# EAGLE design HostInterfaceSplitter (EAGLE 6.6.0)

## Sheet 1 of 2
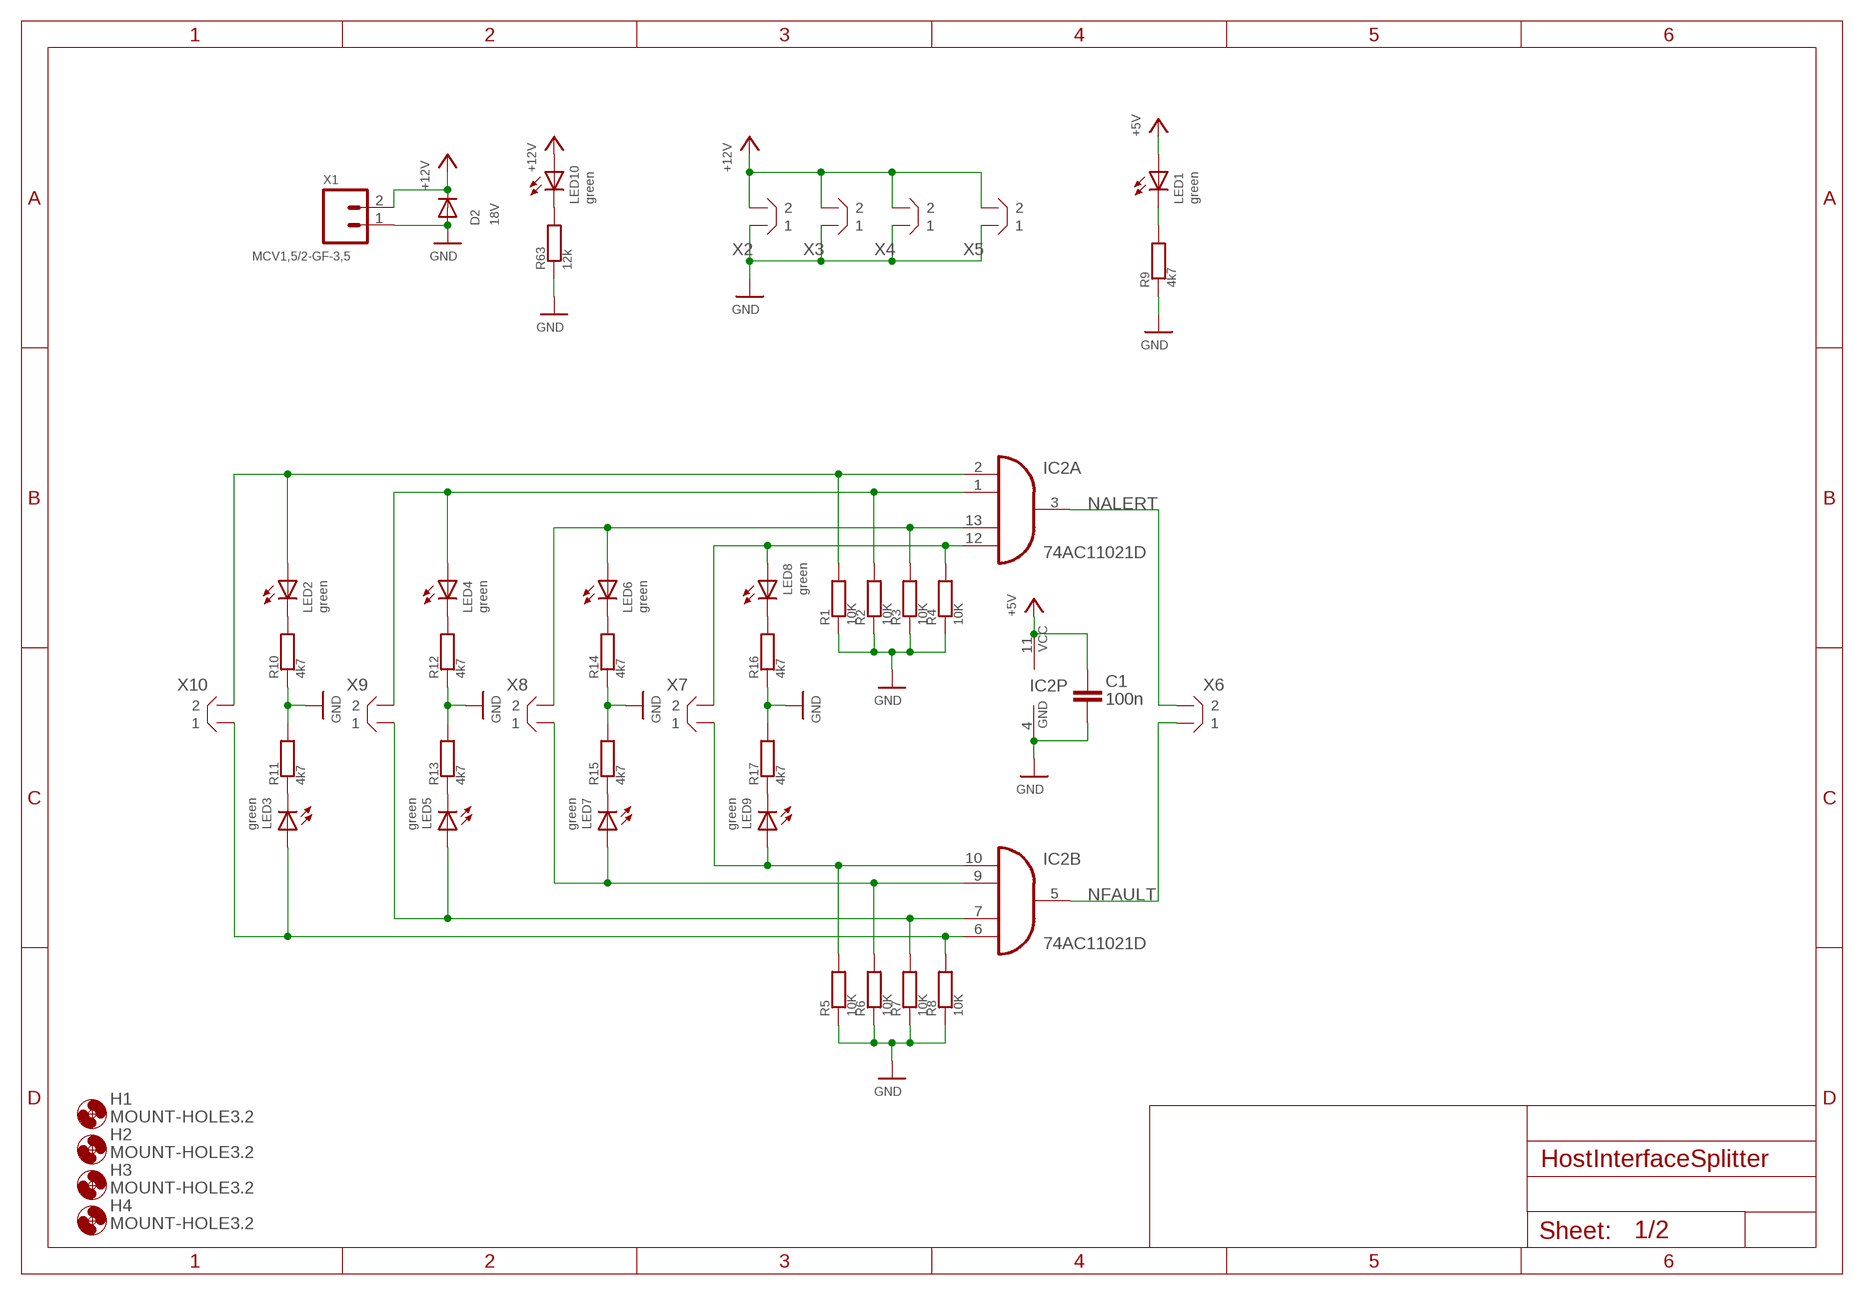
[diagram p0: schematic, sheet 1]

### Parts
C1  100n  C0603  [C0603]
D2  18V  DIODE-DO214AA  [DO214AA]
H1  MOUNT-HOLE3.2  [3,2]
H2  MOUNT-HOLE3.2  [3,2]
H3  MOUNT-HOLE3.2  [3,2]
H4  MOUNT-HOLE3.2  [3,2]
IC2  74AC11021D  [SO14]
LED1  green  LEDCHIP-LED0805  [CHIP-LED0805]
LED2  green  LEDCHIP-LED0805  [CHIP-LED0805]
LED3  green  LEDCHIP-LED0805  [CHIP-LED0805]
LED4  green  LEDCHIP-LED0805  [CHIP-LED0805]
LED5  green  LEDCHIP-LED0805  [CHIP-LED0805]
LED6  green  LEDCHIP-LED0805  [CHIP-LED0805]
LED7  green  LEDCHIP-LED0805  [CHIP-LED0805]
LED8  green  LEDCHIP-LED0805  [CHIP-LED0805]
LED9  green  LEDCHIP-LED0805  [CHIP-LED0805]
LED10  green  LEDCHIP-LED0805  [CHIP-LED0805]
R1  10K  R0603  [R0603]
R2  10K  R0603  [R0603]
R3  10K  R0603  [R0603]
R4  10K  R0603  [R0603]
R5  10K  R0603  [R0603]
R6  10K  R0603  [R0603]
R7  10K  R0603  [R0603]
R8  10K  R0603  [R0603]
R9  4k7  R  [R0805]
R10  4k7  R  [R0805]
R11  4k7  R  [R0805]
R12  4k7  R  [R0805]
R13  4k7  R  [R0805]
R14  4k7  R  [R0805]
R15  4k7  R  [R0805]
R16  4k7  R  [R0805]
R17  4k7  R  [R0805]
R63  12k  R  [R0805]
X1  MCV1,5/2-GF-3,5  [MCV1,5/2-GF-3,5]
X2  B2B-XH  [B2B-XH]
X3  B2B-XH  [B2B-XH]
X4  B2B-XH  [B2B-XH]
X5  B2B-XH  [B2B-XH]
X6  B2B-XH  [B2B-XH]
X7  B2B-XH  [B2B-XH]
X8  B2B-XH  [B2B-XH]
X9  B2B-XH  [B2B-XH]
X10  B2B-XH  [B2B-XH]

### Nets
+5V: C1.2 IC2.11(P:VCC) LED1.A ; also sheet 2
+12V: D2.C LED10.A X1.2 X2.P$2 X3.P$2 X4.P$2 X5.P$2
GND: C1.1 D2.A IC2.4(P:GND) R1.1 R2.1 R3.1 R4.1 R5.1 R6.1 R7.1 R8.1 R9.1 R10.1 R11.2 R12.1 R13.2 R14.1 R15.2 R16.1 R17.2 R63.1 X1.1 X2.P$1 X3.P$1 X4.P$1 X5.P$1 ; also sheet 2
N$1: IC2.6(B:I3) LED3.A R8.2 X10.P$1
N$2: IC2.12(A:I3) LED8.A R4.2 X7.P$2
N$3: IC2.13(A:I2) LED6.A R3.2 X8.P$2
N$4: IC2.1(A:I1) LED4.A R2.2 X9.P$2
N$5: IC2.2(A:I0) LED2.A R1.2 X10.P$2
N$6: IC2.7(B:I2) LED5.A R7.2 X9.P$1
N$7: IC2.9(B:I1) LED7.A R6.2 X8.P$1
N$8: IC2.10(B:I0) LED9.A R5.2 X7.P$1
N$9: LED1.C R9.2
N$10: LED2.C R10.2
N$11: LED3.C R11.1
N$15: LED4.C R12.2
N$16: LED5.C R13.1
N$18: LED6.C R14.2
N$19: LED7.C R15.1
N$22: LED8.C R16.2
N$23: LED9.C R17.1
N$54: LED10.C R63.2
NALERT: IC2.3(A:O) X6.P$2
NFAULT: IC2.5(B:O) X6.P$1

## Sheet 2 of 2
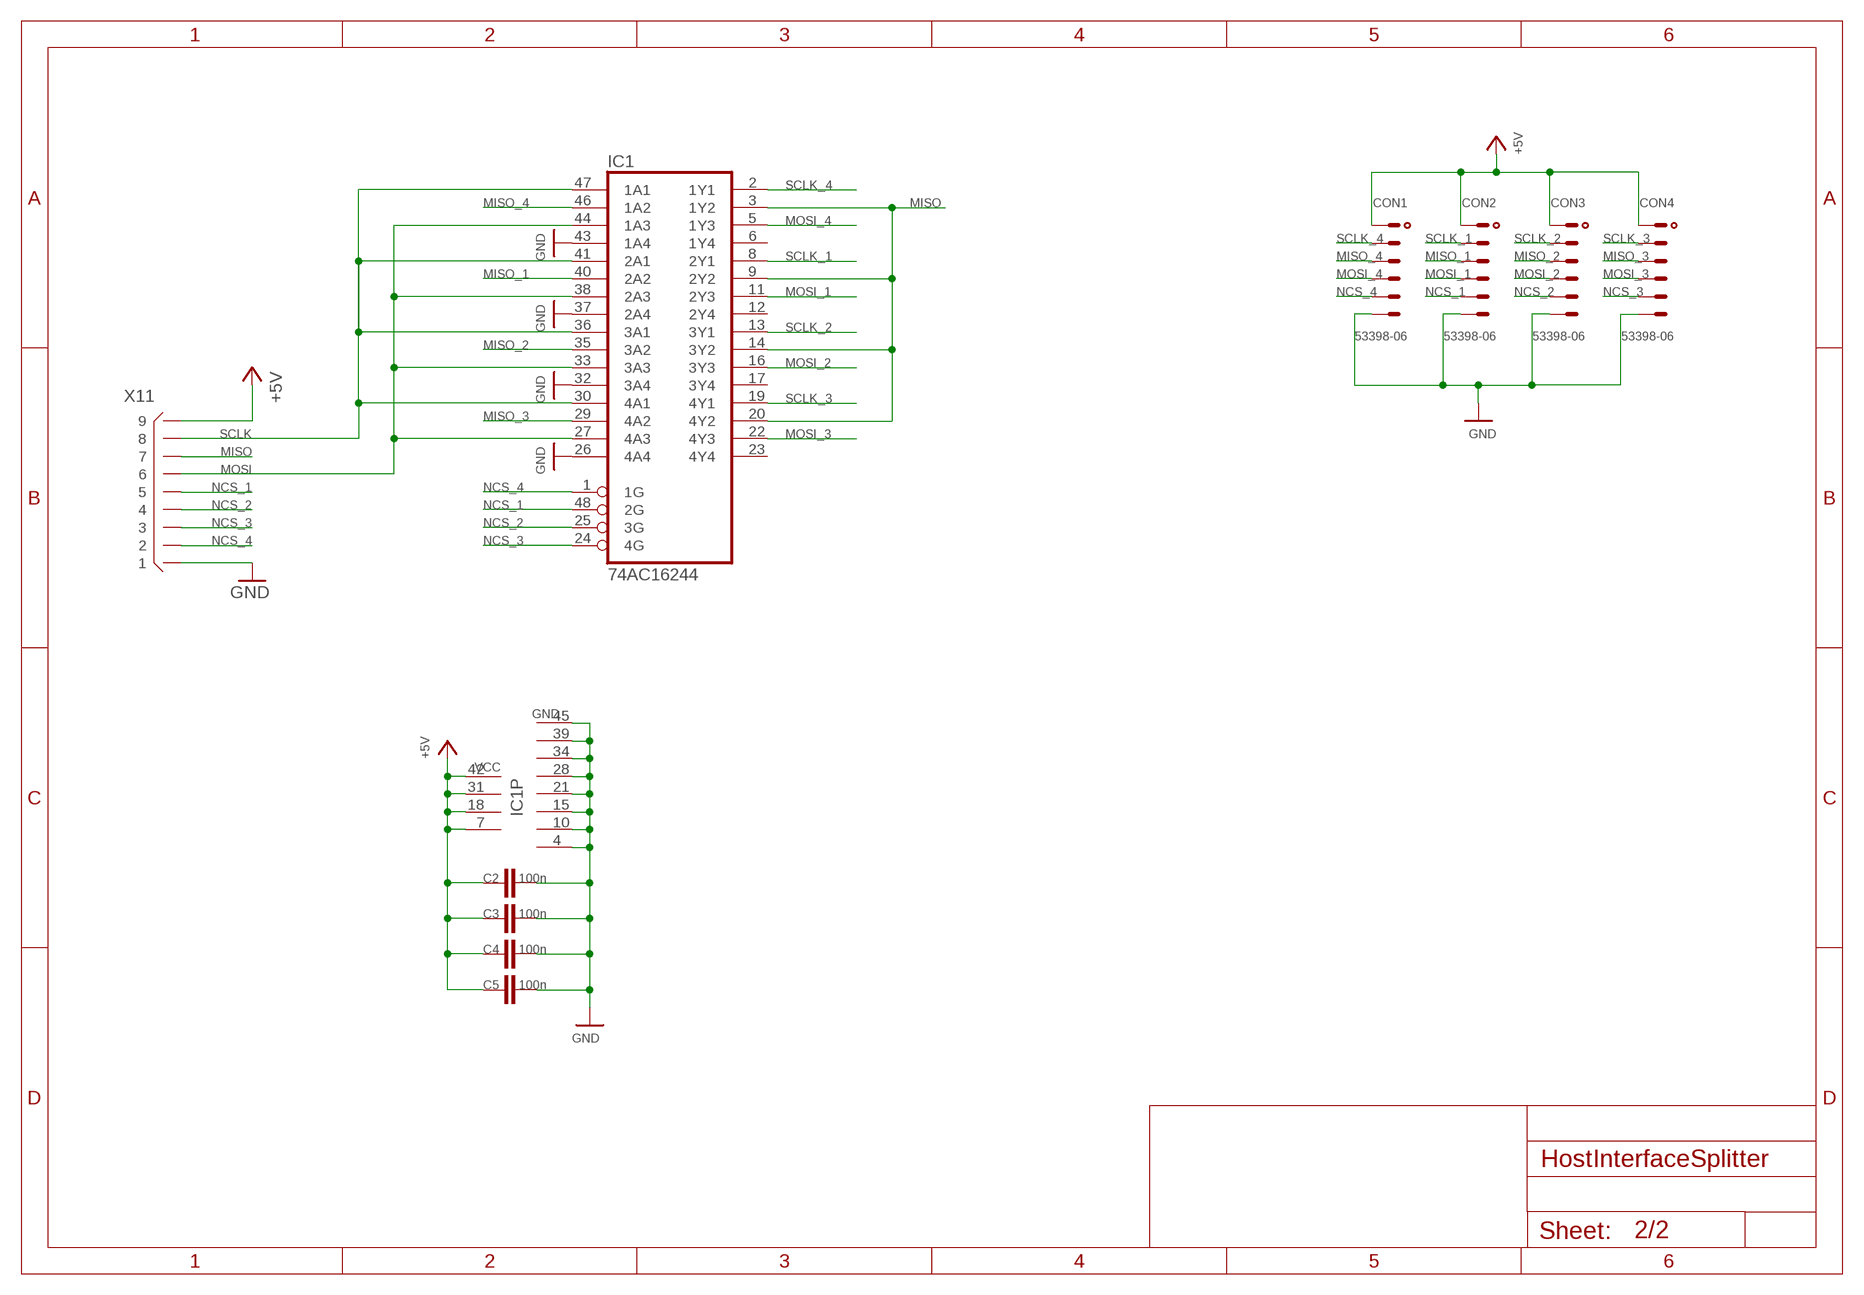
[diagram p1: schematic, sheet 2]

### Parts
C2  100n  C0603  [C0603]
C3  100n  C0603  [C0603]
C4  100n  C0603  [C0603]
C5  100n  C0603  [C0603]
CON1  53398-06  [53398-06]
CON2  53398-06  [53398-06]
CON3  53398-06  [53398-06]
CON4  53398-06  [53398-06]
IC1  74AC16244  [SSOP48DL]
X11  B9B-XH  [B9B-XH]

### Nets
+5V: C2.2 C3.2 C4.2 C5.2 CON1.1 CON2.1 CON3.1 CON4.1 IC1.7(VCC) IC1.18(VCC) IC1.31(VCC) IC1.42(VCC) X11.P$9 ; also sheet 1
GND: C2.1 C3.1 C4.1 C5.1 CON1.6 CON2.6 CON3.6 CON4.6 IC1.4(GND) IC1.10(GND) IC1.15(GND) IC1.21(GND) IC1.26(4A4) IC1.28(GND) IC1.32(3A4) IC1.34(GND) IC1.37(2A4) IC1.39(GND) IC1.43(1A4) IC1.45(GND) X11.P$1 ; also sheet 1
MISO: IC1.3(1Y2) IC1.9(2Y2) IC1.14(3Y2) IC1.20(4Y2) X11.P$7
MISO_1: CON2.3 IC1.40(2A2)
MISO_2: CON3.3 IC1.35(3A2)
MISO_3: CON4.3 IC1.29(4A2)
MISO_4: CON1.3 IC1.46(1A2)
MOSI: IC1.27(4A3) IC1.33(3A3) IC1.38(2A3) IC1.44(1A3) X11.P$6
MOSI_1: CON2.4 IC1.11(2Y3)
MOSI_2: CON3.4 IC1.16(3Y3)
MOSI_3: CON4.4 IC1.22(4Y3)
MOSI_4: CON1.4 IC1.5(1Y3)
NCS_1: CON2.5 IC1.48(2G) X11.P$5
NCS_2: CON3.5 IC1.25(3G) X11.P$4
NCS_3: CON4.5 IC1.24(4G) X11.P$3
NCS_4: CON1.5 IC1.1(1G) X11.P$2
SCLK: IC1.30(4A1) IC1.36(3A1) IC1.41(2A1) IC1.47(1A1) X11.P$8
SCLK_1: CON2.2 IC1.8(2Y1)
SCLK_2: CON3.2 IC1.13(3Y1)
SCLK_3: CON4.2 IC1.19(4Y1)
SCLK_4: CON1.2 IC1.2(1Y1)
Unconnected: IC1.6(1Y4) IC1.12(2Y4) IC1.17(3Y4) IC1.23(4Y4)

## Library data of the parts
C1-C5 = useful:C
CON1-CON4 = con-molex:53?-06: CONNECTOR wire to board 1.25 mm (.049 inch) pitch header
D2 = diode:DIODE-: DIODE
H1-H4 = holes:MOUNT-HOLE: MOUNTING HOLE with drill center marker
IC1 = 74ac-logic:74AC16244: 16-bit BUFFER/LINE DRIVER, 3-state
IC2 = 74ac-logic:74AC11021: Dual 4-input AND
LED1-LED10 = led:LED: LED OSRAM: - CHIPLED LG R971, LG N971, LY N971, LG Q971, LY Q971, LO R971, LY R971 LH N974, LH R974 LS Q976, LO Q976, LY Q976 LO Q996 - Hyper CHIPLED LW Q18S LB Q993, LB Q99A, LB R99A - SideLED LS A670, LO A670, LY A670, LG A670, LP A670 LB A673, LV A673, LT A673, LW A673 LH A674 LY A675 LS A676, LA A676, LO A676, LY A676, LW A676 LS A679, LY A679, LG A679 - Hyper Micro SIDELED® LS Y876, LA Y876, LO Y876, LY Y876 LT Y87S - SmartLED LW L88C, LW L88S LB L89C, LB L89S, LG L890 LS L89K, LO L89K, LY L89K LS L896, LA L896, LO L896, LY L896 - TOPLED LS T670, LO T670, LY T670, LG T670, LP T670 LSG T670, LSP T670, LSY T670, LOP T670, LYG T670 LG T671, LOG T671, LSG T671 LB T673, LV T673, LT T673, LW T673 LH T674 LS T676, LA T676, LO T676, LY T676, LB T676, LH T676, LSB T676, LW T676 LB T67C, LV T67C, LT T67C, LS T67K, LO T67K, LY T67K, LW E67C LS E67B, LA E67B, LO E67B, LY E67B, LB E67C, LV E67C, LT E67C LW T67C LS T679, LY T679, LG T679 LS T770, LO T770, LY T770, LG T770, LP T770 LB T773, LV T773, LT T773, LW T773 LH T774 LS E675, LA E675, LY E675, LS T675 LS T776, LA T776, LO T776, LY T776, LB T776 LHGB T686 LT T68C, LB T68C - Hyper Mini TOPLED® LB M676 - Mini TOPLED Santana® LG M470 LS M47K, LO M47K, LY M47K Source: http://www.osram.convergy.de LUXEON: - LUMILED® LXK2-PW12-R00, LXK2-PW12-S00, LXK2-PW14-U00, LXK2-PW14-V00 LXK2-PM12-R00, LXK2-PM12-S00, LXK2-PM14-U00 LXK2-PE12-Q00, LXK2-PE12-R00, LXK2-PE12-S00, LXK2-PE14-T00, LXK2-PE14-U00 LXK2-PB12-K00, LXK2-PB12-L00, LXK2-PB12-M00, LXK2-PB14-N00, LXK2-PB14-P00, LXK2-PB14-Q00 LXK2-PR12-L00, LXK2-PR12-M00, LXK2-PR14-Q00, LXK2-PR14-R00 LXK2-PD12-Q00, LXK2-PD12-R00, LXK2-PD12-S00 LXK2-PH12-R00, LXK2-PH12-S00 LXK2-PL12-P00, LXK2-PL12-Q00, LXK2-PL12-R00 Source: www.luxeon.com KINGBRIGHT: KA-3528ASYC Source: www.kingbright.com
R1-R17 R63 = useful:R
X1 = con-phoenix:MCV1,5/2-GF-3,5
X2-X10 = con-jst-xh:?2B-XH
X11 = con-jst-xh:?9B-XH

## Board
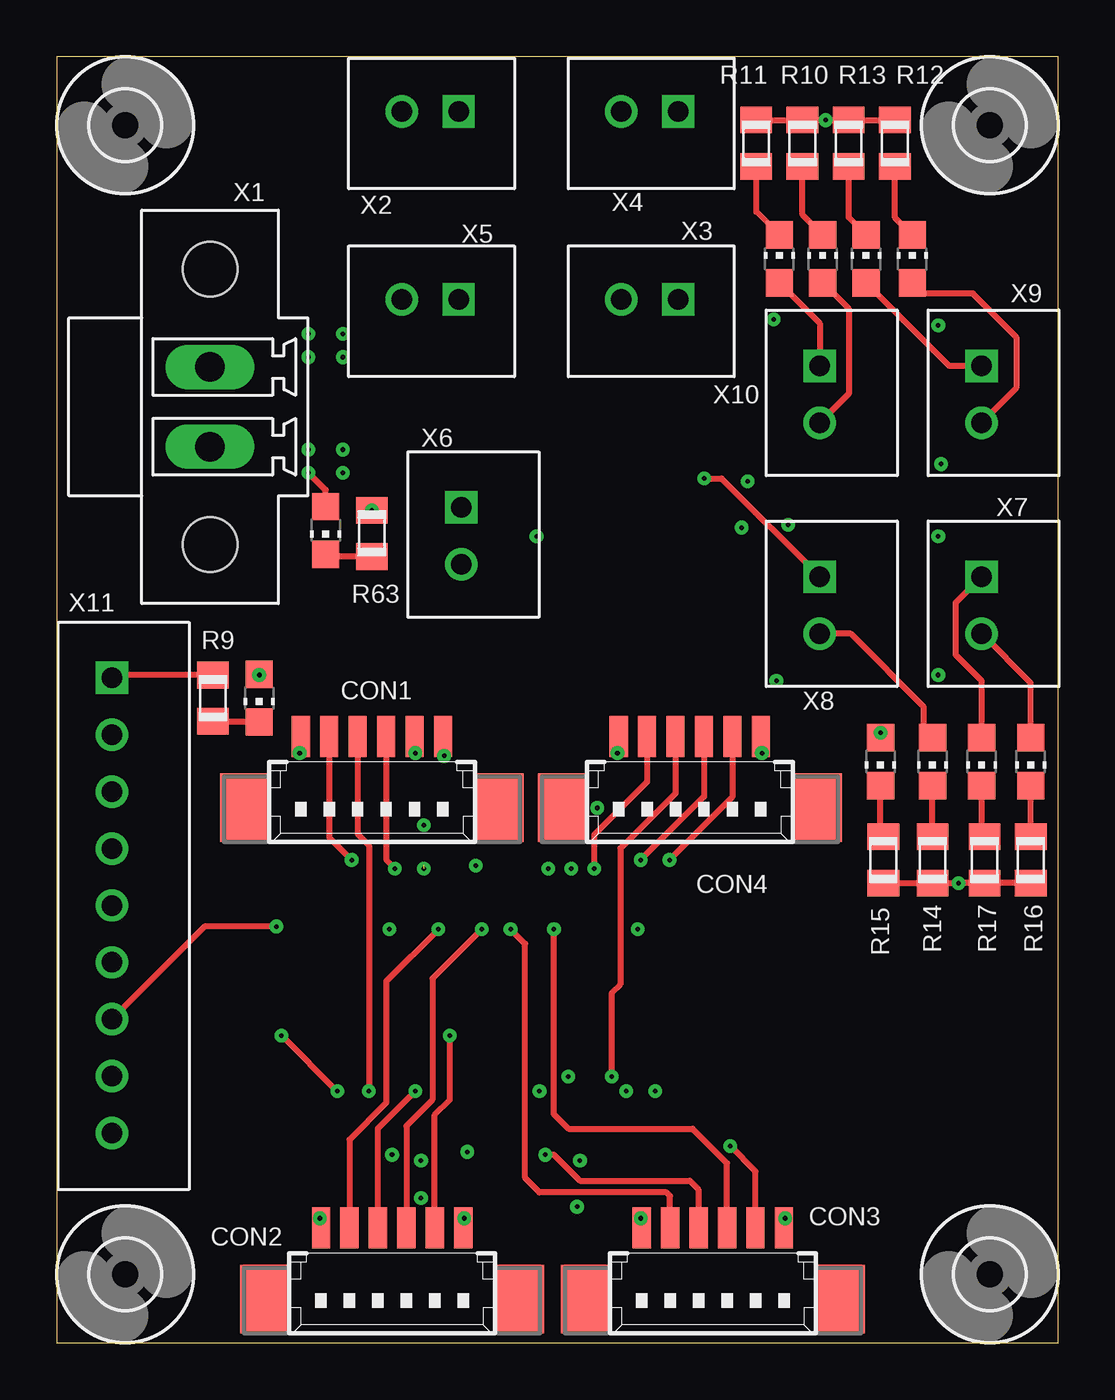
[diagram p2: board, top side]
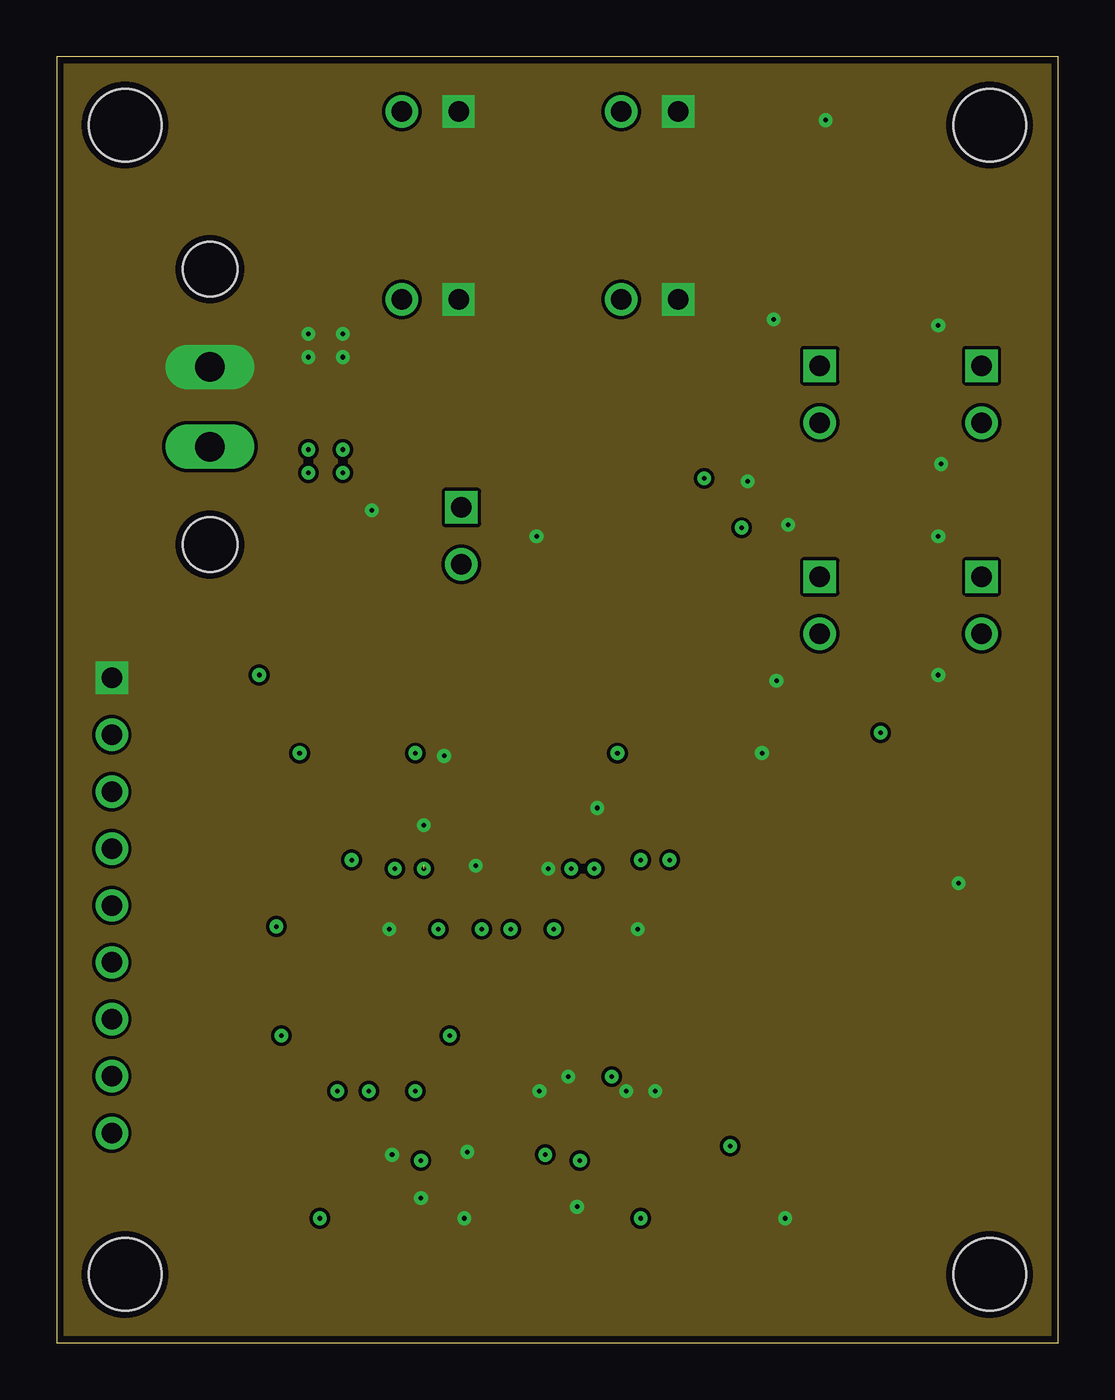
[diagram p3: board, inner layer Route2]
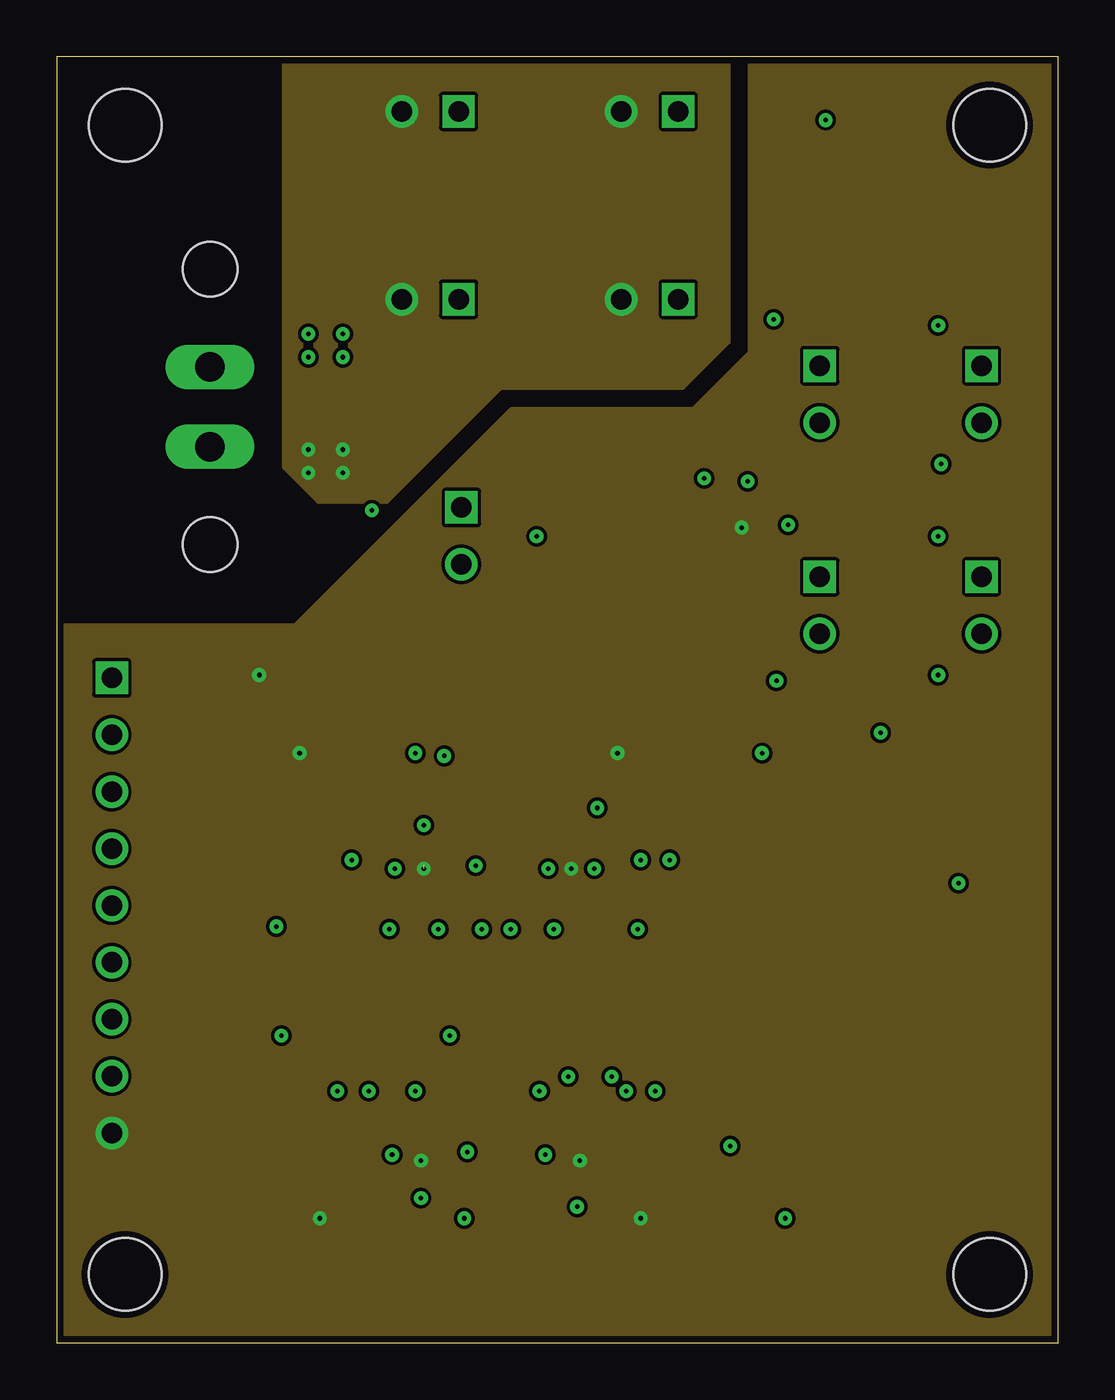
[diagram p4: board, inner layer Route15]
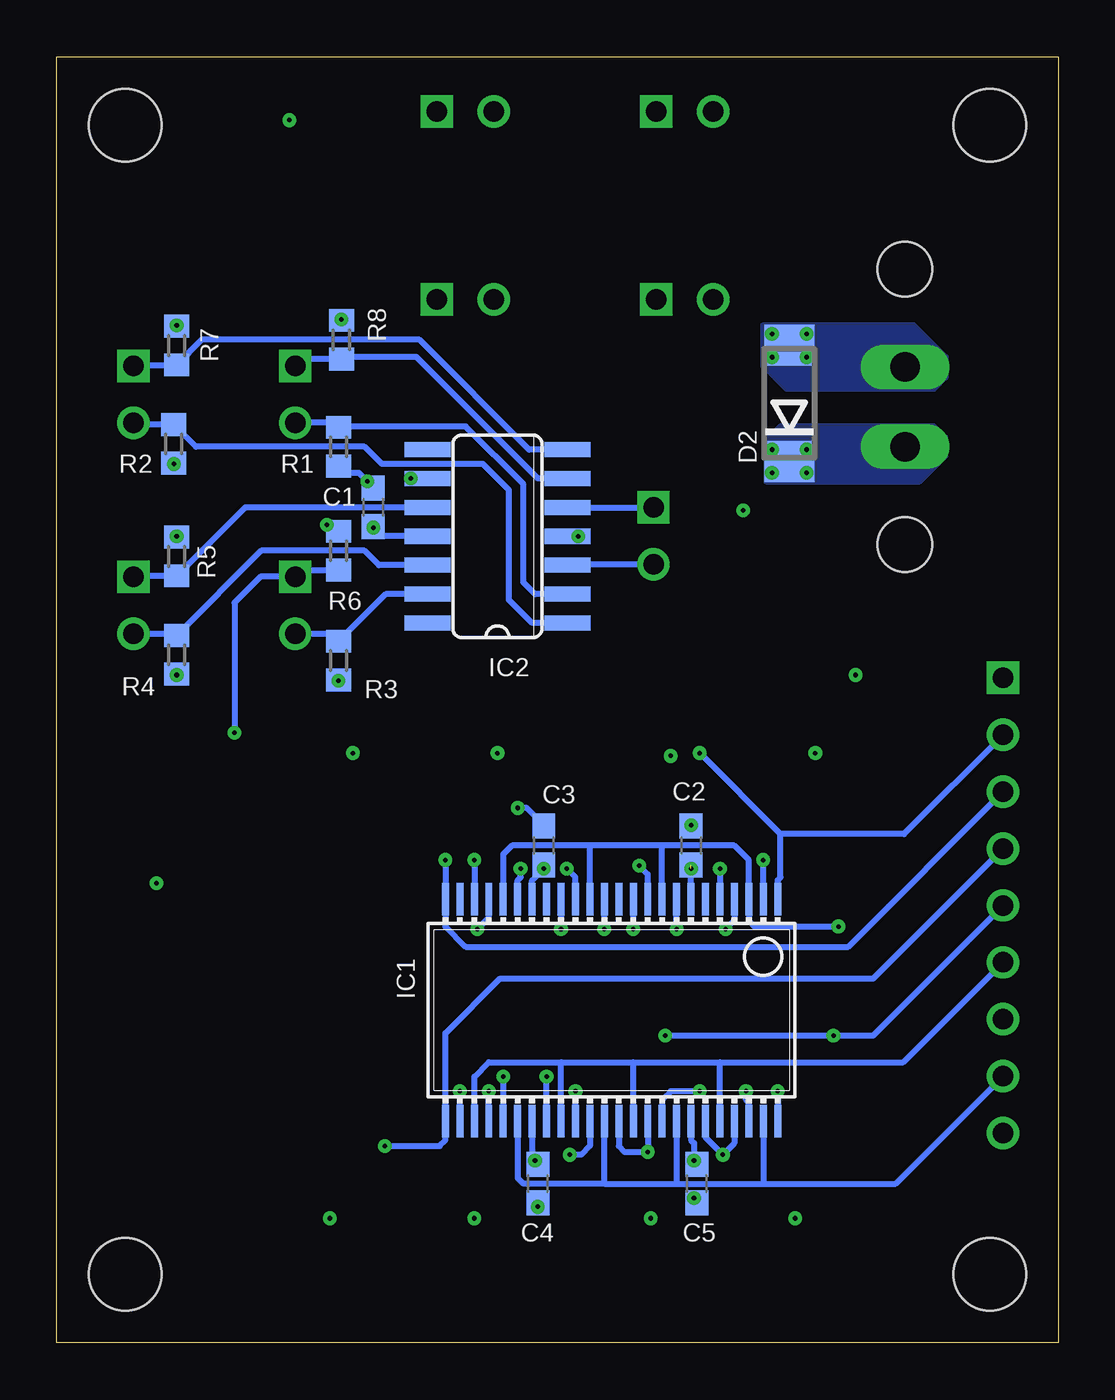
[diagram p5: board, bottom side, seen from below]

Size 44 x 56.5 mm. Coordinates in mm from the lower left corner, seen from the top.
Outline: 0,0 44,0 44,56.5 0,56.5 0,0
Copper layers (1+2*15+16): Top 0.035mm / dielectric 0.2mm / Route2 0.035mm / dielectric 0.5mm / Route15 0.035mm / dielectric 0.2mm / Bottom 0.035mm
Design rules "ats_35u_4layer *": minimum track width 6mil, minimum drill 0.2mm, track to track 6mil, track to pad 6mil, pad to pad 6mil, via to via 6mil, smd to smd 6mil, copper to edge 0.3mm, drill to drill 8mil, minimum pad ring 10mil, minimum via ring 0.2mm, stop-mask expansion 4mil, vias tented up to drill 0mil, thermal gap 10mil

### Footprints (pad centres in the part's own frame; a part is rotated, then mirrored left to right if it is on the bottom)
C0603 = smd 1.1 x 1: 1 -0.85,0; 2 0.85,0
53398-06 = smd 0.8 x 1.8: 1 3.125,-2.5; 2 1.875,-2.5; 3 0.625,-2.5; 4 -0.625,-2.5; 5 -1.875,-2.5; 6 -3.125,-2.5 | smd 2.1 x 3: S1 5.625,0.625; S2 -5.625,0.625
DO214AA = smd 1.8 x 2.2: A 2.55,0; C -2.55,0
3,2 = hole 3.2: 0,0
SSOP48DL = smd 0.305 x 1.422: 1 -6.985,-4.877; 2 -6.35,-4.877; 3 -5.715,-4.877; 4 -5.08,-4.877; 5 -4.445,-4.877; 6 -3.81,-4.877; 7 -3.175,-4.877; 8 -2.54,-4.877; 9 -1.905,-4.877; 10 -1.27,-4.877; 11 -0.635,-4.877; 12 0,-4.877; 13 0.635,-4.877; 14 1.27,-4.877; 15 1.905,-4.877; 16 2.54,-4.877; 17 3.175,-4.877; 18 3.81,-4.877; 19 4.445,-4.877; 20 5.08,-4.877; 21 5.715,-4.877; 22 6.35,-4.877; 23 6.985,-4.877; 24 7.62,-4.877; 25 7.62,4.877; 26 6.985,4.877; 27 6.35,4.877; 28 5.715,4.877; 29 5.08,4.877; 30 4.445,4.877; 31 3.81,4.877; 32 3.175,4.877; 33 2.54,4.877; 34 1.905,4.877; 35 1.27,4.877; 36 0.635,4.877; 37 0,4.877; 38 -0.635,4.877; 39 -1.27,4.877; 40 -1.905,4.877; 41 -2.54,4.877; 42 -3.175,4.877; 43 -3.81,4.877; 44 -4.445,4.877; 45 -5.08,4.877; 46 -5.715,4.877; 47 -6.35,4.877; 48 -6.985,4.877
SO14 = smd 0.66 x 2.032: 1 -3.81,-3.073; 2 -2.54,-3.073; 3 -1.27,-3.073; 4 0,-3.073; 5 1.27,-3.073; 6 2.54,-3.073; 7 3.81,-3.073; 8 3.81,3.073; 9 2.54,3.073; 10 1.27,3.073; 11 0,3.073; 12 -1.27,3.073; 13 -2.54,3.073; 14 -3.81,3.073
CHIP-LED0805 = smd 1.2 x 1.2: A 0,-1.05; C 0,1.05
R0603 = smd 1 x 1.1: 1 -0.85,0; 2 0.85,0
R0805 = smd 1.168 x 1.397: 1 -1.016,0; 2 1.016,0
MCV1,5/2-GF-3,5 = drill 1.3 long: 1 0,3.5; 2 0,0 | hole 2.4: 0,7.8; 0,-4.3
B2B-XH = drill 0.9 pad 1.422 square: P$1 0,0 | drill 0.9 pad 1.422: P$2 2.5,0
B9B-XH = drill 0.9 pad 1.422 square: P$1 0,0 | drill 0.9 pad 1.422: P$2 2.5,0; P$3 5,0; P$4 7.5,0; P$5 10,0; P$6 12.5,0; P$7 15,0; P$8 17.5,0; P$9 20,0

### Placement (x,y rotation side)
C1  30.1,36.7 270 bottom
C2  16.13,21.84 270 bottom
C3  22.61,21.84 270 bottom
C4  22.86,6.99 90 bottom
C5  15.88,6.99 90 bottom
CON1  13.84,24.13 180 top
CON2  14.73,2.54 180 top
CON3  28.83,2.54 180 top
CON4  27.81,24.13 180 top
D2  11.81,41.27 90 bottom
H1  3,53.5 0 top
H2  3,3 0 top
H3  41,3 0 top
H4  41,53.5 0 top
IC1  19.3,14.61 180 bottom
IC2  24.64,35.43 90 bottom
LED1  8.89,28.32 180 top
LED2  33.66,47.62 0 top
LED3  31.75,47.62 0 top
LED4  37.59,47.62 0 top
LED5  35.56,47.62 0 top
LED6  38.48,25.53 180 top
LED7  36.2,25.53 180 top
LED8  42.8,25.53 180 top
LED9  40.64,25.53 180 top
LED10  11.81,35.69 180 top
R1  31.62,39.37 90 bottom
R2  38.86,39.5 90 bottom
R3  31.62,29.97 90 bottom
R4  38.73,30.23 90 bottom
R5  38.73,34.54 270 bottom
R6  31.62,34.8 270 bottom
R7  38.73,43.81 270 bottom
R8  31.5,44.07 270 bottom
R9  6.86,28.32 270 top
R10  32.77,52.7 270 top
R11  30.73,52.7 90 top
R12  36.83,52.7 270 top
R13  34.8,52.7 90 top
R14  38.48,21.21 90 top
R15  36.32,21.21 270 top
R16  42.8,21.21 90 top
R17  40.77,21.21 270 top
R63  13.84,35.56 270 top
X1  6.73,39.37 0 top
X2  17.65,54.1 180 top
X3  27.3,45.85 180 top
X4  27.3,54.1 180 top
X5  17.65,45.85 180 top
X6  17.78,36.7 270 top
X7  40.64,33.66 270 top
X8  33.53,33.66 270 top
X9  40.64,42.93 270 top
X10  33.53,42.93 270 top
X11  2.41,29.21 270 top

### Tracks (layer width: path | path; a pad name or v marks a point on that pad's centre or on a via)
+5V  (via drill 0.2)  (1 unrouted)
  Top 0.254: LED1.A v8.89,29.34 | CON1.1 10.72,25.96 v10.67,25.91 | CON4.1 24.69,25.96 v24.64,25.91 | CON3.1 25.7,5.79 v25.65,5.46 | CON2.1 11.61,5.41 v11.56,5.46
  Bottom 0.254: IC1.7 v16.13,20.83 | IC1.18 23.11,20.32 v22.61,20.83 C3.2 | IC1.42 16.13,8.89 16,8.76 v16,8 C5.2 | IC2.11 29.72,35.43 v30.1,35.81 C1.2 | IC1.31 23.11,8.13 v22.99,8 22.86,8 C4.2
  pour Route15 (no thermals): 0,31.5 10.5,31.5 20,41 28,41 30.5,43.5 30.5,56.5 44,56.5 44,0 0,0
+12V  (via drill 0.2)
  Top 0.254: LED10.A 11.81,37.47 v11.05,38.23
  other vias: 12.57,38.23 11.05,39.24 12.57,39.24
  pour Bottom (no thermals): 5.46,40.26 12.19,40.26 12.83,39.62 12.83,37.85 6.1,37.85 4.95,38.99 4.95,39.75
  pour Route15 (no thermals): 29.5,56.5 10,56.5 10,38.5 11.5,37 14.5,37 19.5,42 27.5,42 29.5,44
GND  (via drill 0.2)
  Top 0.254: R9.1 2.54,29.34 X11.P$1 | R11.2 R10.1 v33.78,53.72 R13.2 R12.1 | R16.1 R17.2 v39.62,20.19 R14.1 R15.2 | CON1.6 16.97,25.83 v17.02,25.78 | CON4.6 30.94,25.96 v30.99,25.91 | CON3.6 31.95,5.16 v32,5.46 | CON2.6 17.86,5.41 v17.91,5.46
  Bottom 0.254: IC1.4 14.22,18.54 v14.61,18.16 | IC1.10 18.03,20.57 v18.41,20.95 | IC1.15 21.21,20.45 v21.59,20.83 | IC1.21 25.02,18.67 v25.53,18.16 | IC1.45 14.22,8.76 v14.73,8.26 15.49,9.02 IC1.43 | IC1.39 v18.03,8.38 19.05,8.38 19.3,8.64 IC1.37 | IC1.34 v21.21,11.05 | IC1.28 v25.02,11.05 | IC2.4 v21.08,35.43 | R8.1 v31.5,44.96 | v38.73,44.7 R7.1 | R2.1 v38.86,38.61 | v32.13,35.94 R6.1 | v38.73,35.43 R5.1 | R4.1 38.7,29.38 v38.73,29.34 | v31.62,29.08 R3.1 | IC1.26 v26.29,11.05 | IC1.32 v22.48,11.68 | R1.1 31.54,38.52 31.24,38.23 30.73,38.23 v30.35,37.85 | C2.1 v16.13,22.73 | C3.1 22.61,22.73 23.37,23.5 v23.75,23.5 | C4.1 v22.86,5.97 | C5.1 15.88,6.35 v16,6.35
  Bottom 0.406: C1.1 30.35,37.55 v30.35,37.85
  other vias: 12.57,44.32 11.05,44.32 11.05,43.31 12.57,43.31 13.84,36.58
  pour Bottom (no thermals): 5.46,41.91 11.94,41.91 12.95,42.93 12.95,44.7 6.35,44.7 4.95,43.31 4.95,42.42
  pour Route2 (no thermals): 44,56.5 44,0 0,0 0,56.5
MISO  (via drill 0.2)
  Top 0.254: X11.P$7 6.49,18.29 v9.65,18.29
  Bottom 0.254: 17.4,21.84 14.22,21.84 13.59,21.21 IC1.3 13.59,18.54 13.34,18.29 v9.65,18.29 | 17.4,21.84 20.57,21.84 | 20.57,21.84 24,21.84 24.38,21.46 IC1.20 | IC1.9 17.4,21.84 | IC1.14 20.57,21.84
MISO_1  (via drill 0.2)
  Top 0.254: CON2.3 14.11,9.41 v15.75,11.05
  Bottom 0.254: v15.75,11.05 17.02,11.05 17.4,10.67 IC1.40
MISO_2  (via drill 0.2)
  Top 0.254: CON3.3 28.19,5.18 28.19,6.73 27.81,7.11 22.99,7.11 21.84,8.26 v21.46,8.26
  Bottom 0.254: IC1.35 20.57,8.64 20.95,8.26 v21.46,8.26
MISO_3  (via drill 0.2)
  Top 0.254: CON4.3 27.19,24.14 24.77,21.72 24.77,15.75 24.38,15.37 v24.38,11.68
  Bottom 0.254: v24.38,11.68 IC1.29
MISO_4  (via drill 0.2)
  Top 0.254: CON1.3 13.22,22.34 13.72,21.84 v13.72,11.05
  Bottom 0.254: IC1.46 13.59,10.54 13.72,10.67 v13.72,11.05
MOSI
  Bottom 0.254: IC1.27 25.65,11.68 25.02,12.32 21.84,12.32 | 21.84,12.32 18.67,12.32 | 18.67,12.32 14.86,12.32 | IC1.44 14.86,12.32 | IC1.38 18.67,12.32 | IC1.33 21.84,12.32 | 14.86,12.32 6.8,12.32 X11.P$6
MOSI_1  (via drill 0.2)
  Top 0.254: v18.67,18.16 16.51,16 16.51,10.67 15.36,9.52 CON2.4
  Bottom 0.254: v18.67,18.16 IC1.11
MOSI_2  (via drill 0.2)
  Top 0.254: CON3.4 29.45,7.88 27.94,9.4 22.48,9.4 21.84,10.03 v21.84,18.16
  Bottom 0.254: IC1.16 v21.84,18.16
MOSI_3  (via drill 0.2)
  Top 0.254: CON4.4 28.44,23.99 v25.65,21.21
  Bottom 0.254: v25.65,21.21 IC1.22
MOSI_4  (via drill 0.2)
  Top 0.254: CON1.4 14.47,21.22 v14.86,20.83
  Bottom 0.254: v14.86,20.83 IC1.5
N$1
  Top 0.254: LED3.A 33.53,44.8 X10.P$1
  Bottom 0.254: X10.P$1 33.23,43.22 R8.2 31.41,43.31 28.19,43.31 22.86,37.97 IC2.6
N$2
  Top 0.254: LED8.A 42.8,29 X7.P$2
  Bottom 0.254: IC2.12 29.84,34.16 30.48,34.8 35.01,34.8 R4.2 38.94,31.16 X7.P$2
N$3
  Top 0.254: LED6.A 38.48,26.67 38.1,27.05 38.1,27.94 34.88,31.16 X8.P$2
  Bottom 0.254: X8.P$2 31.96,31.16 R3.2 29.55,32.89 IC2.13
N$4
  Top 0.254: X9.P$2 42.16,41.95 42.16,44.2 40.26,46.1 38.1,46.1 37.63,46.58 LED4.A
  Bottom 0.254: IC2.1 23.11,31.62 24.13,32.64 24.13,37.47 25.27,38.61 29.72,38.61 30.48,39.37 37.88,39.37 R2.2 40.56,40.35 X9.P$2
N$5
  Top 0.254: LED2.A 34.8,45.43 34.8,41.7 X10.P$2
  Bottom 0.254: X10.P$2 31.83,40.43 R1.2 31.58,40.26 26.04,40.26 23.5,37.72 23.5,33.4 22.99,32.89 IC2.2
N$6
  Top 0.254: LED5.A 39.21,42.93 X9.P$1
  Bottom 0.254: X9.P$1 38.77,42.93 R7.2 37.63,44.07 28.07,44.07 23.24,39.24 IC2.7
N$7  (via drill 0.2)
  Top 0.254: v36.2,26.8 LED7.A | v28.45,37.97 29.21,37.97 X8.P$1
  Bottom 0.254: v36.2,26.8 36.2,32.51 35.05,33.66 X8.P$1 33.23,33.95 R6.2 | IC2.9 v28.45,37.97
N$8
  Top 0.254: LED9.A 40.64,29.08 39.5,30.23 39.5,32.51 X7.P$1
  Bottom 0.254: IC2.10 35.73,36.7 R5.2 40.6,33.69 X7.P$1
N$9
  Top 0.254: LED1.C 6.89,27.27 R9.2
N$10
  Top 0.254: LED2.C 32.77,49.56 R10.2
N$11
  Top 0.254: LED3.C 30.73,49.69 R11.1
N$15
  Top 0.254: LED4.C 36.83,49.44 R12.2
N$16
  Top 0.254: LED5.C 34.8,49.44 R13.1
N$18
  Top 0.254: R14.2 LED6.C
N$19
  Top 0.254: R15.1 36.2,22.35 LED7.C
N$22
  Top 0.254: R16.2 LED8.C
N$23
  Top 0.254: R17.1 40.64,22.35 LED9.C
N$54
  Top 0.254: R63.2 11.9,34.54 LED10.C
NALERT
  Bottom 0.254: IC2.3 21.52,34.2 X6.P$2
NCS_1  (via drill 0.2)
  Top 0.254: v9.87,13.49 v12.32,11.05 | CON2.5 16.61,10 17.27,10.67 v17.27,13.49
  Bottom 0.254: v12.32,11.05 IC1.48 | v17.27,13.49 v9.87,13.49 8.13,13.49 X11.P$5
NCS_2  (via drill 0.2)
  Top 0.254: CON3.5 30.7,7.52 v29.59,8.64
  Bottom 0.254: v29.59,8.64 27.18,8.64 26.92,8.89 IC1.25 26.92,13.59 24.52,15.99 8.13,15.99 X11.P$4
NCS_3  (via drill 0.2)
  Top 0.254: CON4.5 29.69,23.97 v26.92,21.21
  Bottom 0.254: v26.92,21.21 IC1.24 26.92,18.29 26.04,17.4 9.22,17.4 X11.P$3
NCS_4  (via drill 0.2)
  Top 0.254: v15.75,25.91 15.75,26.53 CON1.5
  Bottom 0.254: IC1.1 12.32,20.32 12.19,20.45 12.19,22.35 | 12.19,22.35 v15.75,25.91 | X11.P$2 6.77,22.35 12.19,22.35
NFAULT
  Bottom 0.254: IC2.5 X6.P$1
SCLK
  Bottom 0.254: IC1.30 23.75,7.24 23.5,6.99 19.94,6.99 | 19.94,6.99 IC1.36 | 19.94,6.99 16.76,6.99 | 16.76,6.99 12.95,6.99 | IC1.47 12.95,6.99 | IC1.41 16.76,6.99 | 12.95,6.99 7.14,6.99 X11.P$8
SCLK_1  (via drill 0.2)
  Top 0.254: v16.76,18.16 14.48,15.88 14.48,10.54 12.86,8.92 CON2.2
  Bottom 0.254: v16.76,18.16 IC1.8
SCLK_2  (via drill 0.2)
  Top 0.254: CON3.2 26.95,6.45 26.8,6.6 21.21,6.6 20.57,7.24 20.57,17.53 v19.94,18.16
  Bottom 0.254: v19.94,18.16 IC1.13
SCLK_3  (via drill 0.2)
  Top 0.254: v23.62,20.83 23.62,22.32 25.94,24.64 CON4.2
  Bottom 0.254: IC1.19 23.75,20.32 23.62,20.45 v23.62,20.83
SCLK_4  (via drill 0.2)
  Top 0.254: v12.95,21.21 11.97,22.2 CON1.2
  Bottom 0.254: IC1.2 v12.95,21.21

### Text on the board
tTest: BMS Host Interface / Splitter V1 | TERA TU Graz / Pöschl Rene
tDocu: F | A | F | A | F | A | F | A